# Altium schematic sheet Power_Inverter_350VDC.SchDoc
size 1200 x 800 mm; SheetNumber: 1; SheetTotal: 1
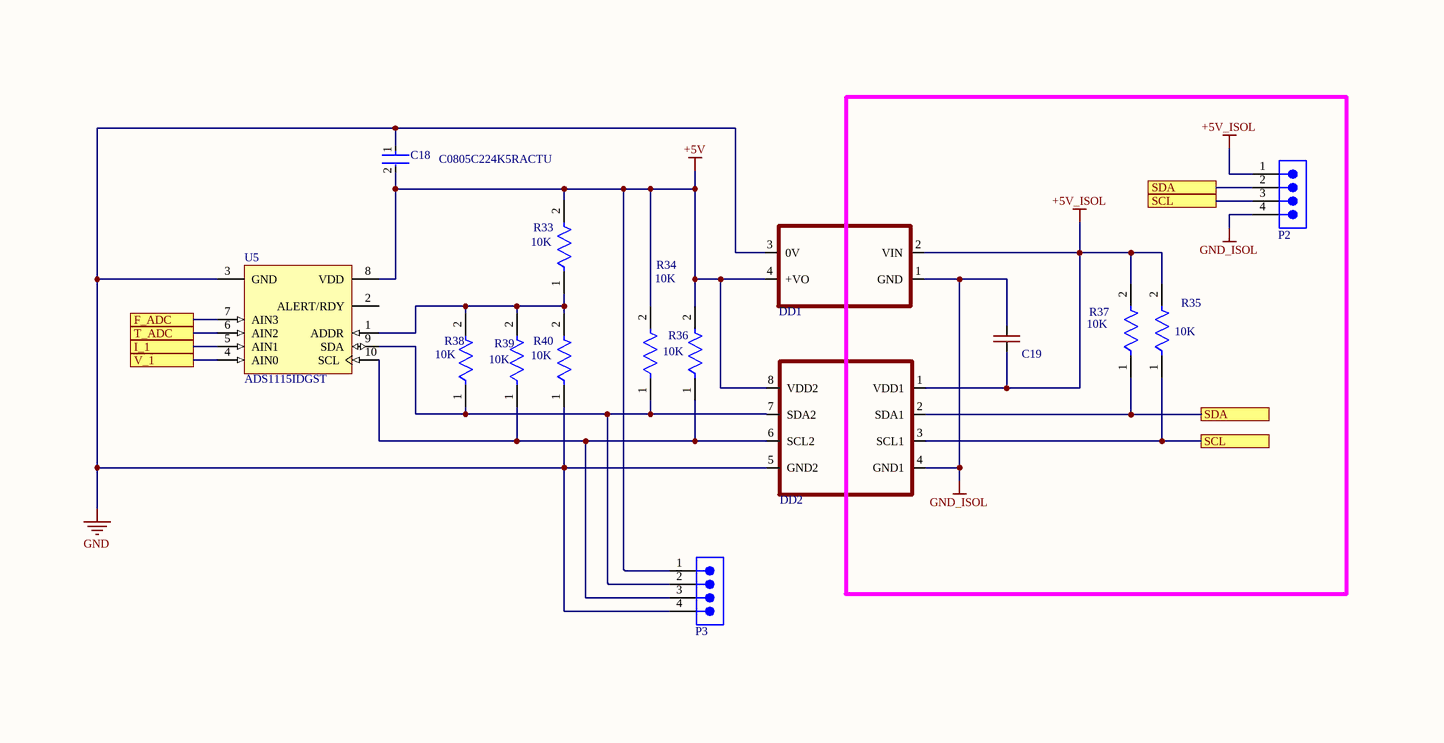
[diagram p0: Power_Inverter_350VDC.SchDoc, top column 1 of 4]
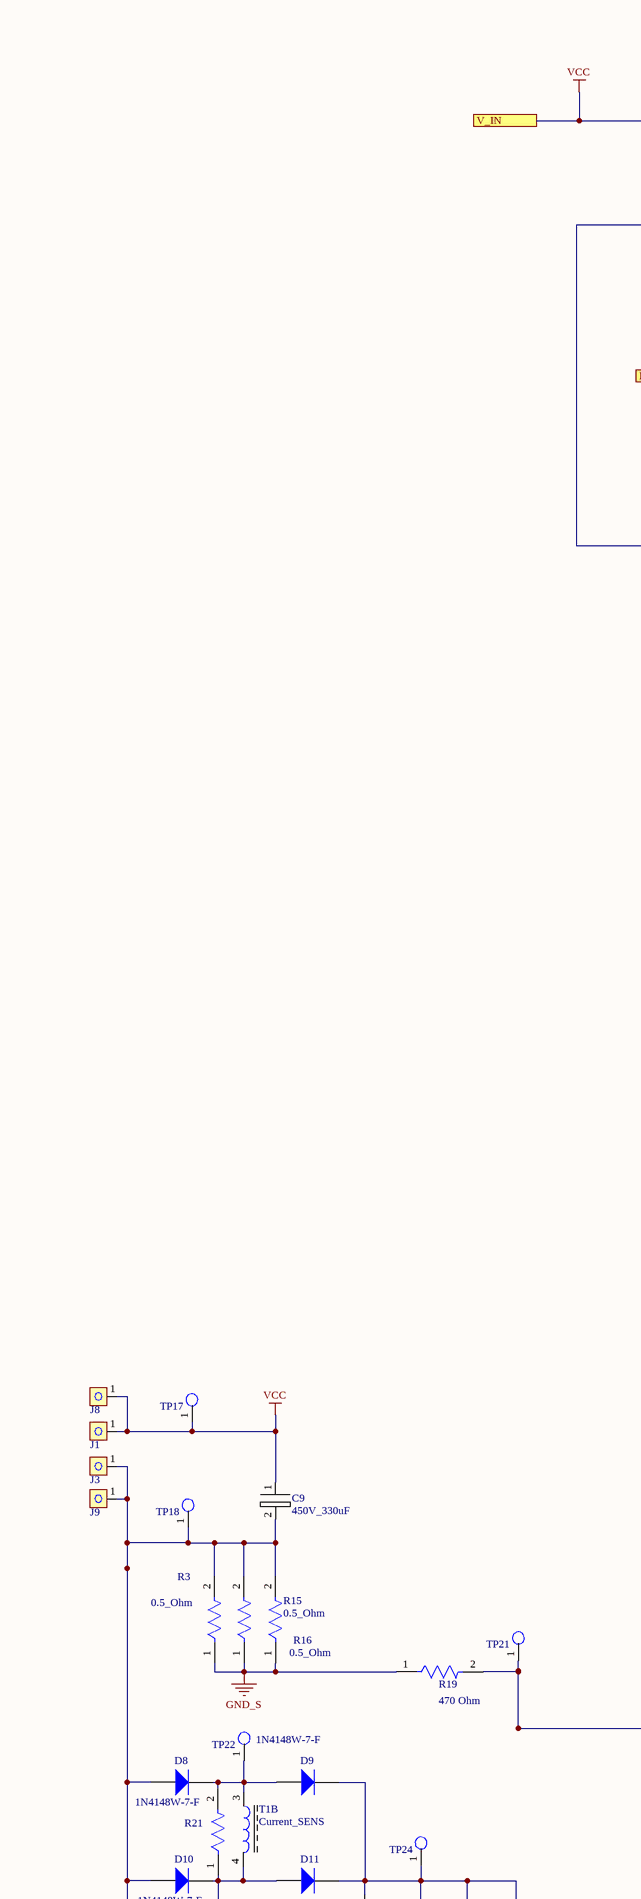
[diagram p1: Power_Inverter_350VDC.SchDoc, top column 2 of 4]
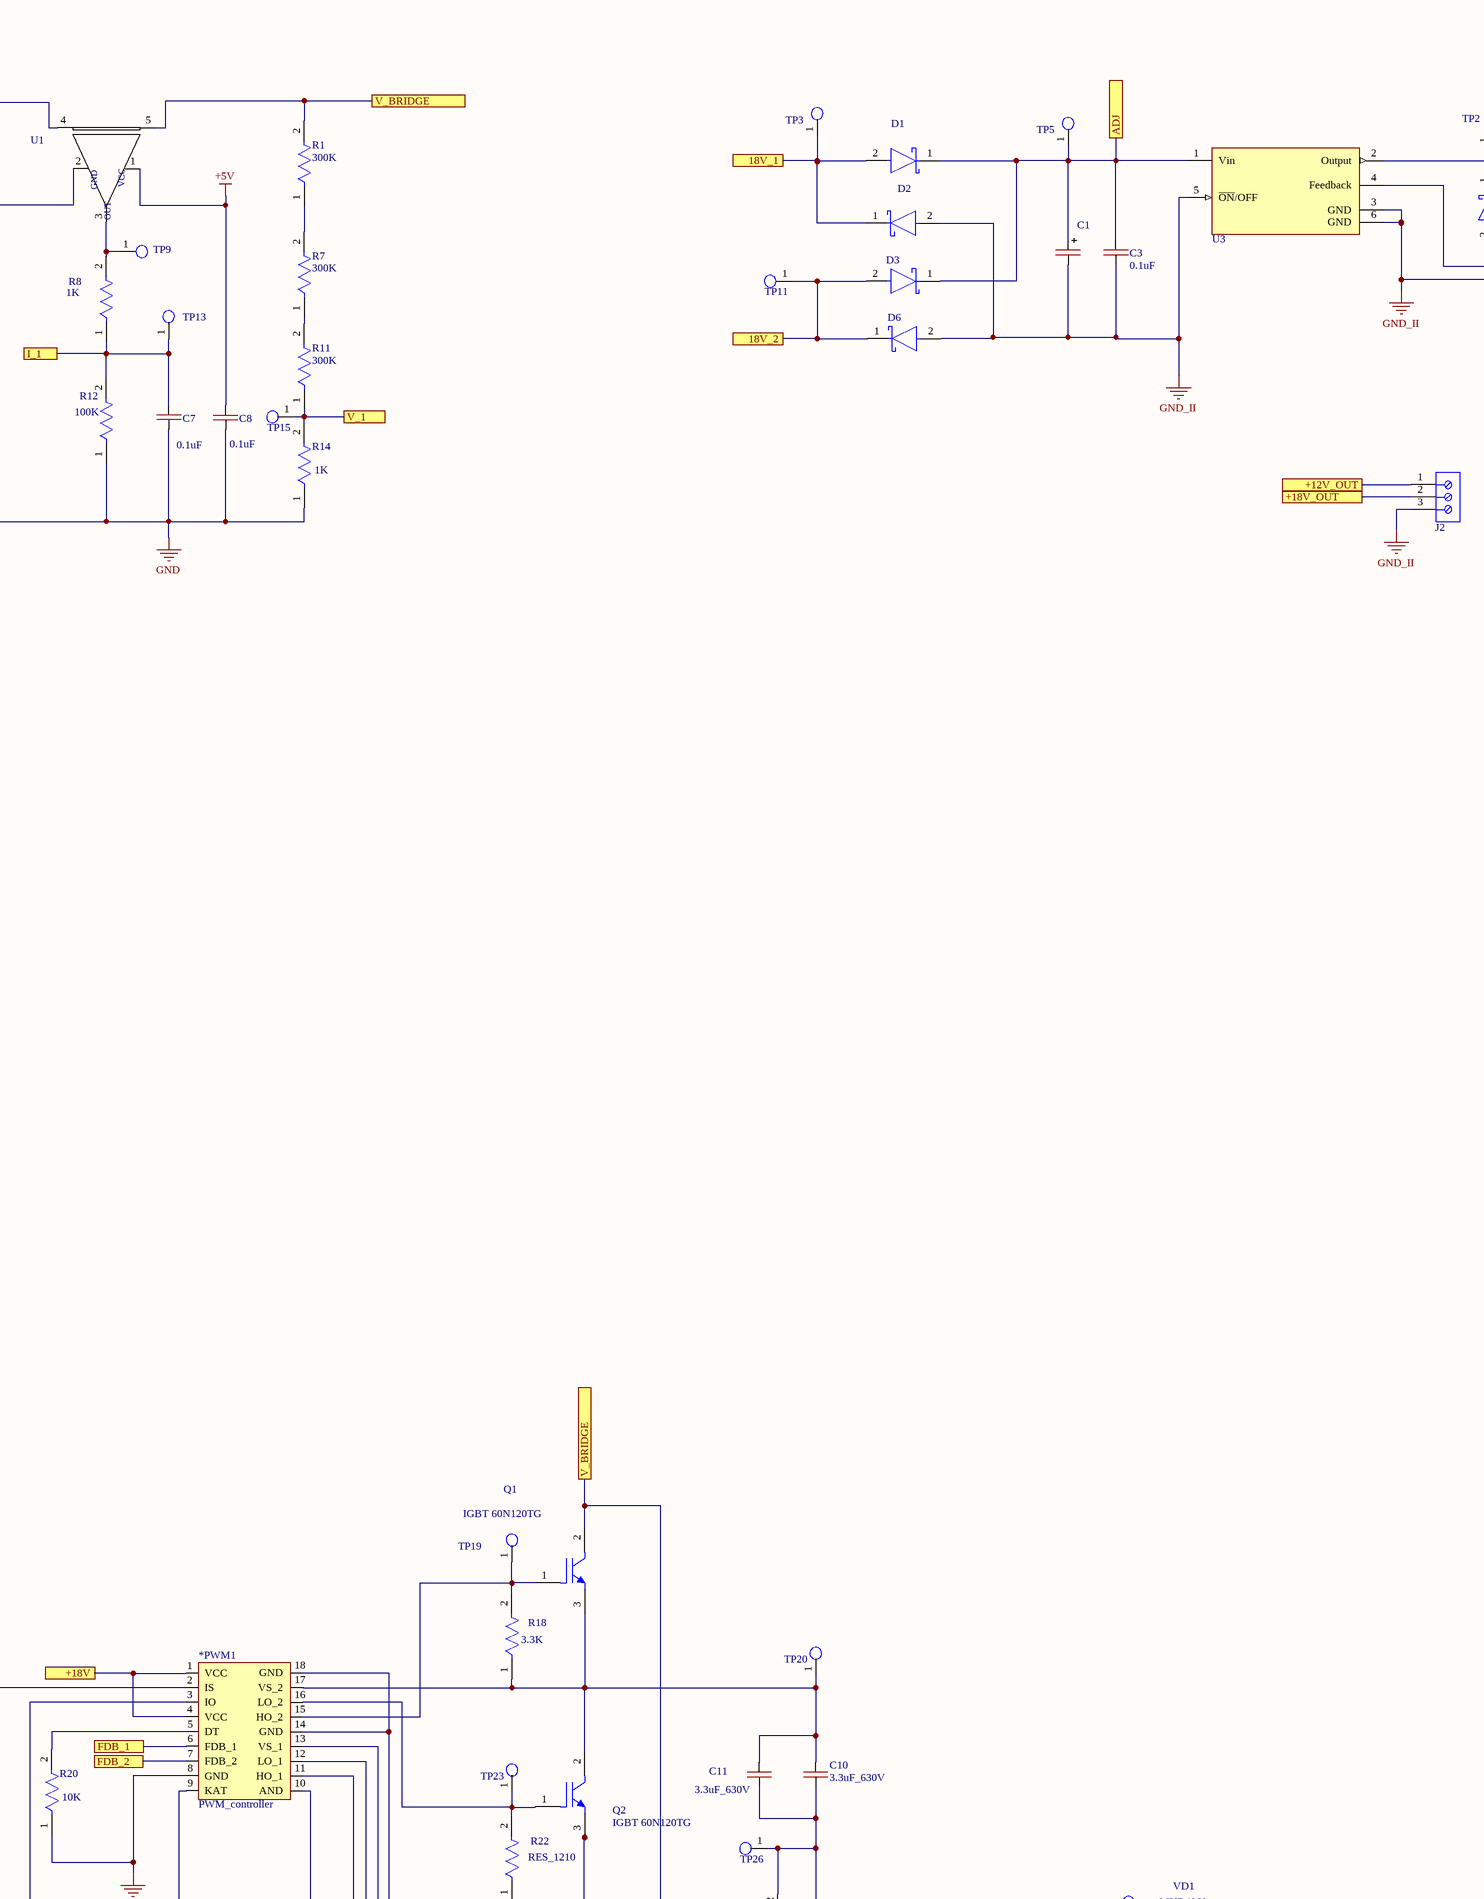
[diagram p2: Power_Inverter_350VDC.SchDoc, top column 3 of 4]
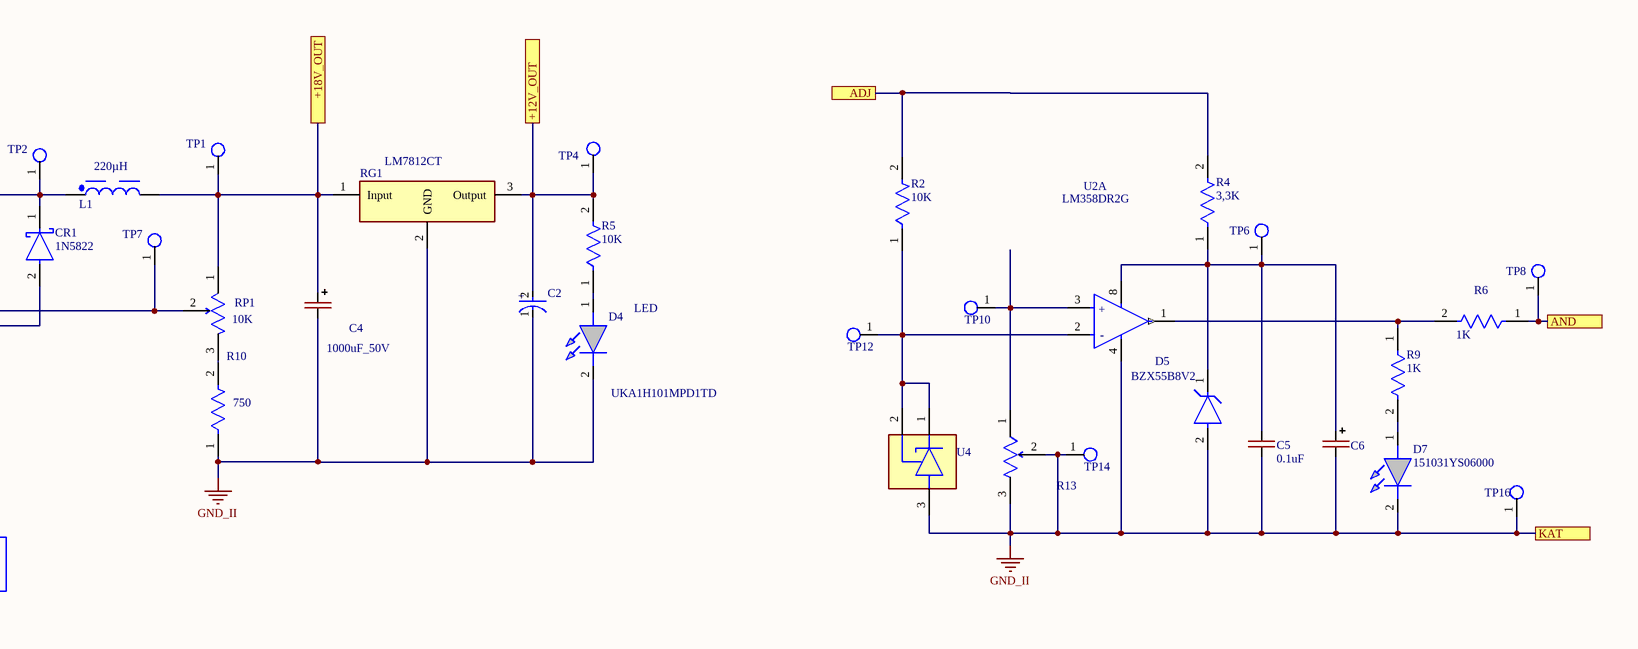
[diagram p3: Power_Inverter_350VDC.SchDoc, top column 4 of 4]
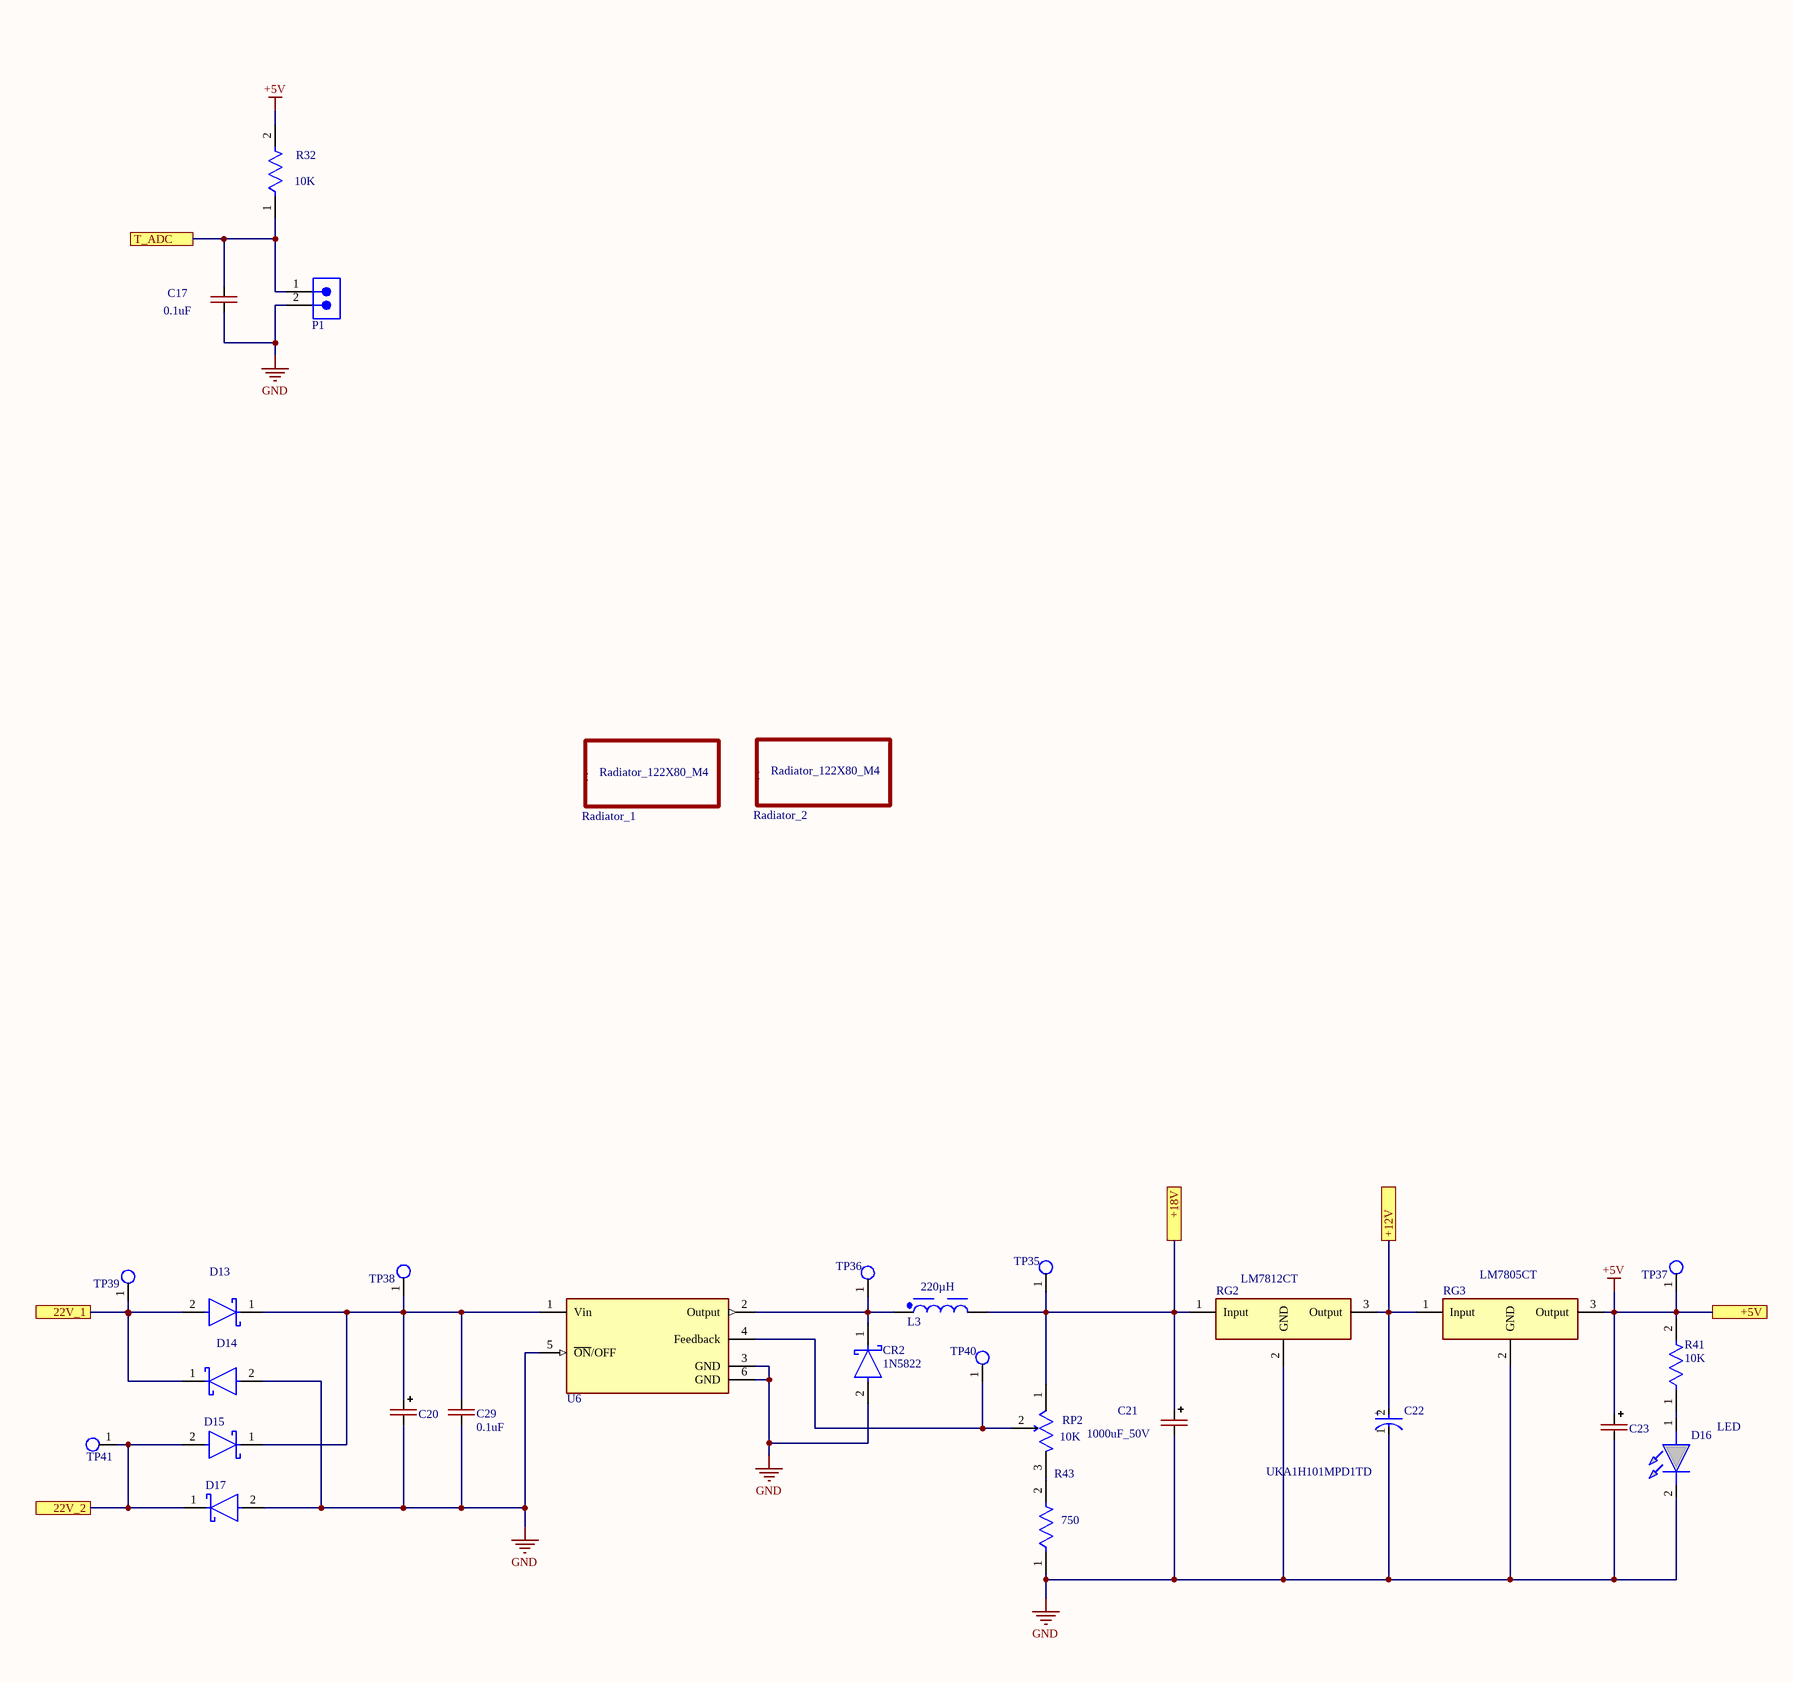
[diagram p4: Power_Inverter_350VDC.SchDoc, bottom column 1 of 4]
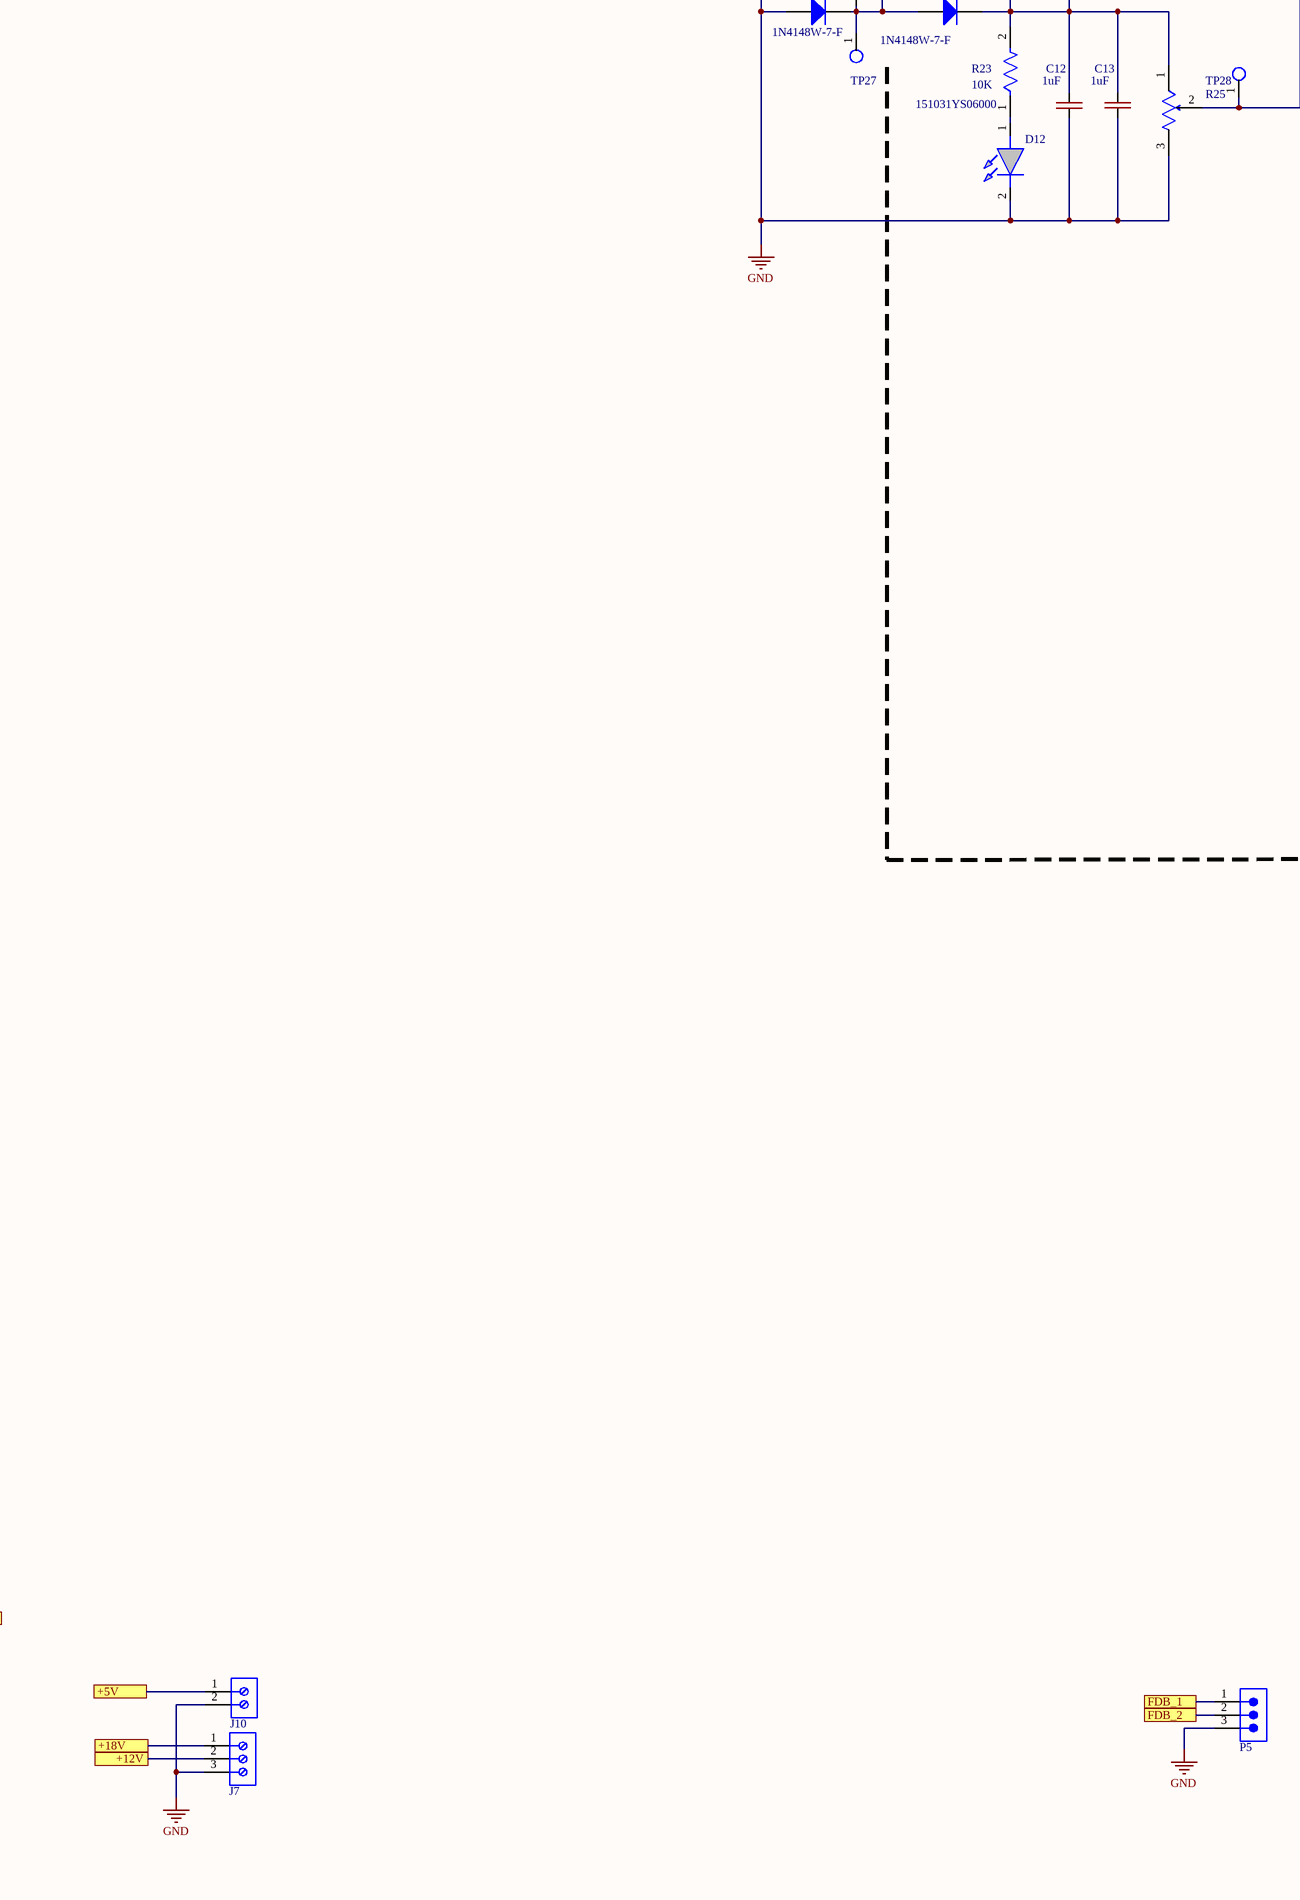
[diagram p5: Power_Inverter_350VDC.SchDoc, bottom column 2 of 4]
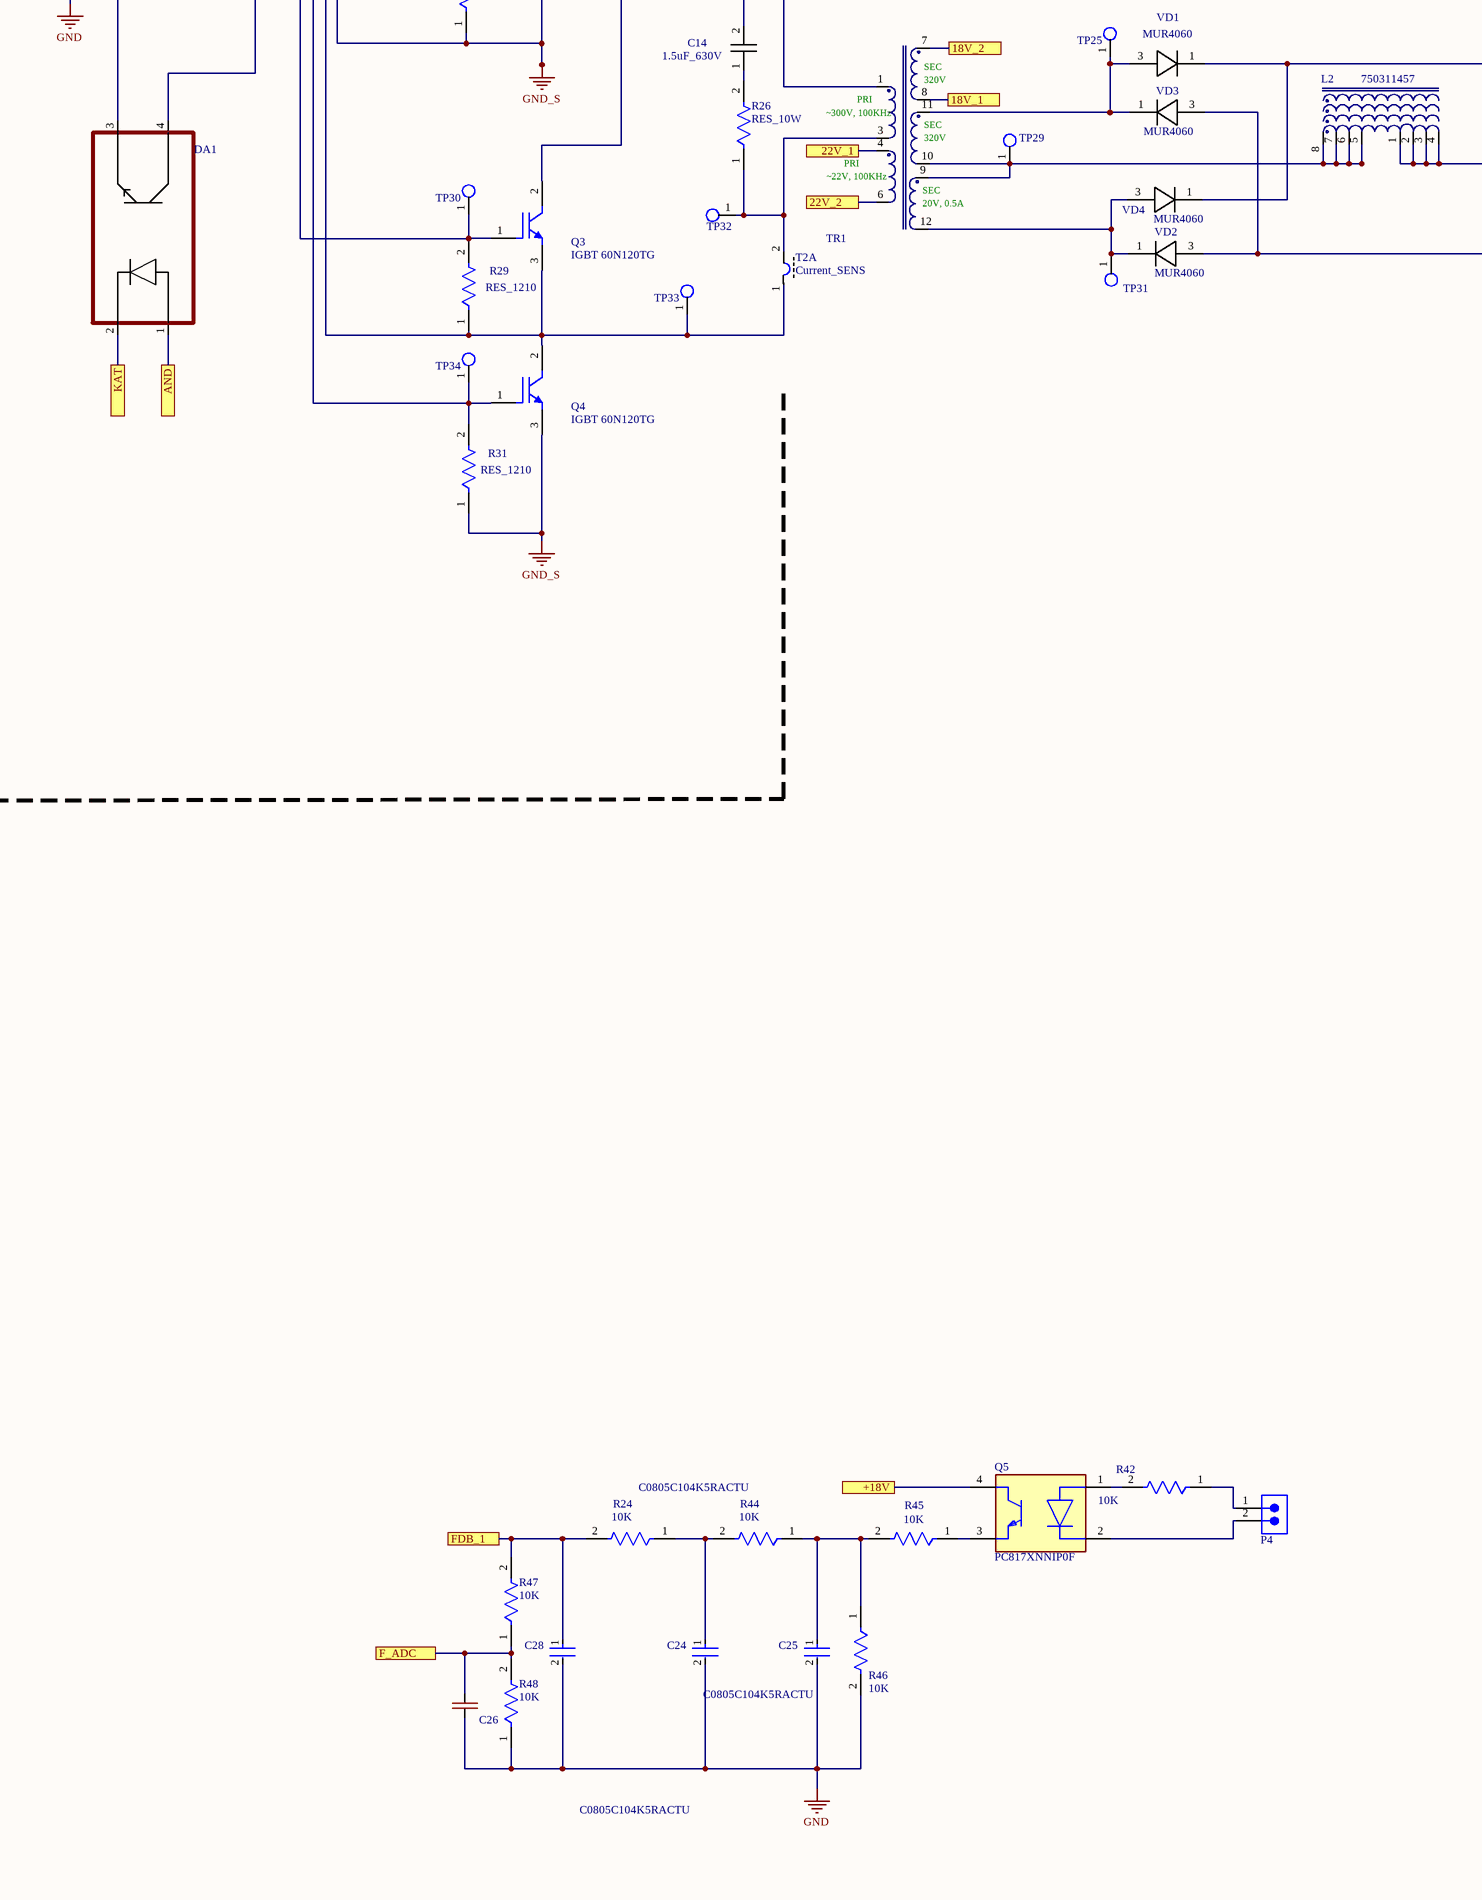
[diagram p6: Power_Inverter_350VDC.SchDoc, bottom column 3 of 4]
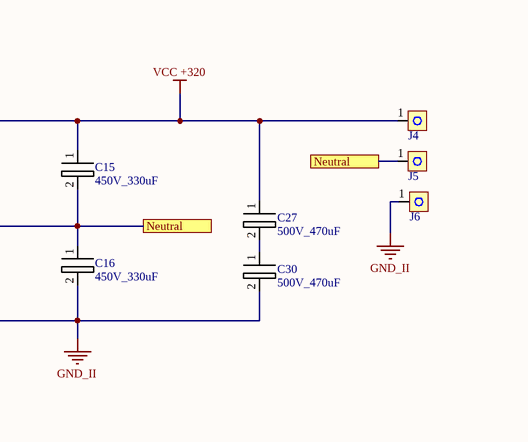
[diagram p7: Power_Inverter_350VDC.SchDoc, bottom column 4 of 4]

## Parts
*PWM1  PWM_controller  [PWM_controller]
C1  CAP-POLAR  [CAPPOL-16x25]  (value not drawn)
C2  UKA1H101MPD1TD  [FP-UKA1H101MPD1TD-MFG]
C3  0.1uF  [CAP-0805]
C4  1000uF_50V  [CAP_POL_13x26_1000uF_50V]
C5  0.1uF  [CAP-0805]
C6  CAP-POLAR  [CAP-TAN-D]  (value not drawn)
C7  0.1uF  [CAP-0805]
C8  0.1uF  [CAP-0805]
C9  450V_330uF  [CAP_450V_330uF]
C10  3.3uF_630V  [CAP_4.7uF_630V]
C11  3.3uF_630V  [CAP_4.7uF_630V]
C12  1uF  [CAP-0805]
C13  1uF  [CAP-0805]
C14  1.5uF_630V  [CAP_1.5uf_400V]
C15  450V_330uF  [CAP_450V_330uF]
C16  450V_330uF  [CAP_450V_330uF]
C17  0.1uF  [CAP-0805]
C18  C0805C224K5RACTU  [FP-C0805C-DN-MFG]
C19  CAP-NON-POLAR  [CAP-0805]  (value not drawn)
C20  CAP-POLAR  [CAPPOL-16x25]  (value not drawn)
C21  1000uF_50V  [CAP_POL_13x26_1000uF_50V]
C22  UKA1H101MPD1TD  [FP-UKA1H101MPD1TD-MFG]
C23  CAP-POLAR  [CAPPOL-16x25]  (value not drawn)
C24  C0805C104K5RACTU  [FP-C0805C-DN-MFG]
C25  C0805C104K5RACTU  [FP-C0805C-DN-MFG]
C26  CAP-NON-POLAR  [CAP-0805]  (value not drawn)
C27  500V_470uF  [CAP_450V_330uF]
C28  C0805C104K5RACTU  [FP-C0805C-DN-MFG]
C29  0.1uF  [CAP-0805]
C30  500V_470uF  [CAP_450V_330uF]
CR1  1N5822  [FP-DO-201AD-MFG]
CR2  1N5822  [FP-DO-201AD-MFG]
D1  (no value)  [SR5100(DO-201AD]
D2  (no value)  [SR5100(DO-201AD]
D3  (no value)  [SR5100(DO-201AD]
D4  LED  [LED_GREEN]
D5  BZX55B8V2  [BZX55B8V2]
D6  (no value)  [SR5100(DO-201AD]
D7  151031YS06000  [LED_BLUE]
D8  1N4148W-7-F  [DIOD-SOD123-2_V]
D9  1N4148W-7-F  [DIOD-SOD123-2_V]
D10  1N4148W-7-F  [DIOD-SOD123-2_V]
D11  1N4148W-7-F  [DIOD-SOD123-2_V]
D12  151031YS06000  [LED_GREEN]
D13  (no value)  [SR5100(DO-201AD]
D14  (no value)  [SR5100(DO-201AD]
D15  (no value)  [SR5100(DO-201AD]
D16  LED  [LED_GREEN]
D17  (no value)  [SR5100(DO-201AD]
DA1  PC817  [4-SMD]  (value not drawn)
DD1  B0505S-1W  [PLS-4-2.54mm]  (value not drawn)
DD2  ADUM1250ARZ  [SO8-150]  (value not drawn)
J1  MG_136_HT  [Conn_MEIGAN_MG136HT]  (value not drawn)
J2  691101710003  [691101710003]  (value not drawn)
J3  MG_136_HT  [Conn_MEIGAN_MG136HT]  (value not drawn)
J4  MG_136_HT  [Conn_MEIGAN_MG136HT]  (value not drawn)
J5  MG_136_HT  [Conn_MEIGAN_MG136HT]  (value not drawn)
J6  MG_136_HT  [Conn_MEIGAN_MG136HT]  (value not drawn)
J7  691101710003  [691101710003]  (value not drawn)
J8  MG_136_HT  [Conn_MEIGAN_MG136HT]  (value not drawn)
J9  MG_136_HT  [Conn_MEIGAN_MG136HT]  (value not drawn)
J10  691101710002  [691101710002]  (value not drawn)
L1  220µH  [WE-PD2_1054]
L2  750311457  [Drossel]
L3  220µH  [WE-PD2_1054]
P1  61900211121  [61900211121]  (value not drawn)
P2  61900411121  [61900411121]  (value not drawn)
P3  61900411121  [61900411121]  (value not drawn)
P4  61900211121  [61900211121]  (value not drawn)
P5  61900311121  [61900311121]  (value not drawn)
Q1  IGBT 60N120TG  [TO-264-3]
Q2  IGBT 60N120TG  [TO-264-3]
Q3  IGBT 60N120TG  [TO-264-3]
Q4  IGBT 60N120TG  [TO-264-3]
Q5  PC817XNNIP0F  [FP-PC817XNNIP0F-MFG]
R1  300K  [RES-1206]
R2  10K  [RES-1206]
R3  0.5_Ohm  [RES_5W_Ceramic_Yageo]
R4  3,3K  [RES-1206]
R5  10K  [FP-CRCW0805-e3-MFG]
R6  1K  [RES-0805]
R7  300K  [RES-1206]
R8  1K  [RES-0805]
R9  1K  [RES-0805]
R10  750  [RES-0805]
R11  300K  [RES-1206]
R12  100K  [RES-0805]
R13  10K  [RES_Adj_3296W_Bourns]  (value not drawn)
R14  1K  [FP-CRCW1210-e3-IPC_A]
R15  0.5_Ohm  [RES_5W_Ceramic_Yageo]
R16  0.5_Ohm  [RES_5W_Ceramic_Yageo]
R18  3.3K  [RES_SMD_1210_IPC_A]
R19  470 Ohm  [RES-0805]
R20  10K  [FP-CRCW1210-e3-IPC_A]
R21  CRCW12100000Z0EA  [FP-CRCW1210-e3-IPC_B]  (value not drawn)
R22  RES_1210  [RES_SMD_1210_IPC_A]
R23  10K  [RES-0805]
R24  10K  [RES-0805]
R25  3296W-1-202LF  [RES_Adj_3296W_Bourns]  (value not drawn)
R26  RES_10W  [10W 3 Ohm]
R29  RES_1210  [RES_SMD_1210_IPC_A]
R31  RES_1210  [RES_SMD_1210_IPC_A]
R32  10K  [RES-0805]
R33  10K  [RES-0805]
R34  10K  [RES-0805]
R35  10K  [RES-0805]
R36  10K  [RES-0805]
R37  10K  [RES-0805]
R38  10K  [RES-0805]
R39  10K  [RES-0805]
R40  10K  [RES-0805]
R41  10K  [FP-CRCW0805-e3-MFG]
R42  10K  [RES-0805]
R43  750  [RES-0805]
R44  10K  [RES-0805]
R45  10K  [RES-0805]
R46  10K  [RES-0805]
R47  10K  [RES-0805]
R48  10K  [RES-0805]
Radiator_1  Radiator_122X80_M4  [Radiator_122X80_M4]  (value not drawn)
Radiator_2  Radiator_122X80_M4  [Radiator_122X80_M4]  (value not drawn)
RG1  LM7812CT  [TO-220_Bended_Rad]
RG2  LM7812CT  [TO-220_Bended_Rad]
RG3  LM7805CT  [TO-220_Bended_Rad]
RP1  10K  [RES_Adj_3296W_Bourns]
RP2  10K  [RES_Adj_3296W_Bourns]
T1  Current_SENS  [Current_Sens_Case]  (part B of 2)
T2  Current_SENS  [Current_Sens_Case]  (part A of 2)
TP1  Test_Point_PCB  [Test_Point]  (value not drawn)
TP2  Test_Point_PCB  [Test_Point]  (value not drawn)
TP3  Test_Point_PCB  [Test_Point]  (value not drawn)
TP4  Test_Point_PCB  [Test_Point]  (value not drawn)
TP5  Test_Point_PCB  [Test_Point]  (value not drawn)
TP6  Test_Point_PCB  [Test_Point]  (value not drawn)
TP7  Test_Point_PCB  [Test_Point]  (value not drawn)
TP8  Test_Point_PCB  [Test_Point]  (value not drawn)
TP9  Test_Point_PCB  [Test_Point]  (value not drawn)
TP10  Test_Point_PCB  [Test_Point]  (value not drawn)
TP11  Test_Point_PCB  [Test_Point]  (value not drawn)
TP12  Test_Point_PCB  [Test_Point]  (value not drawn)
TP13  Test_Point_PCB  [Test_Point]  (value not drawn)
TP14  Test_Point_PCB  [Test_Point]  (value not drawn)
TP15  Test_Point_PCB  [Test_Point]  (value not drawn)
TP16  Test_Point_PCB  [Test_Point]  (value not drawn)
TP17  (no value)  [Test_Point]
TP18  Test_Point_PCB  [Test_Point]  (value not drawn)
TP19  Test_Point_PCB  [Test_Point]  (value not drawn)
TP20  Test_Point_PCB  [Test_Point]  (value not drawn)
TP21  Test_Point_PCB  [Test_Point]  (value not drawn)
TP22  Test_Point_PCB  [Test_Point]  (value not drawn)
TP23  Test_Point_PCB  [Test_Point]  (value not drawn)
TP24  Test_Point_PCB  [Test_Point]  (value not drawn)
TP25  Test_Point_PCB  [Test_Point]  (value not drawn)
TP26  Test_Point_PCB  [Test_Point]  (value not drawn)
TP27  Test_Point_PCB  [Test_Point]  (value not drawn)
TP28  Test_Point_PCB  [Test_Point]  (value not drawn)
TP29  Test_Point_PCB  [Test_Point]  (value not drawn)
TP30  Test_Point_PCB  [Test_Point]  (value not drawn)
TP31  Test_Point_PCB  [Test_Point]  (value not drawn)
TP32  Test_Point_PCB  [Test_Point]  (value not drawn)
TP33  Test_Point_PCB  [Test_Point]  (value not drawn)
TP34  Test_Point_PCB  [Test_Point]  (value not drawn)
TP35  Test_Point_PCB  [Test_Point]  (value not drawn)
TP36  Test_Point_PCB  [Test_Point]  (value not drawn)
TP37  Test_Point_PCB  [Test_Point]  (value not drawn)
TP38  Test_Point_PCB  [Test_Point]  (value not drawn)
TP39  Test_Point_PCB  [Test_Point]  (value not drawn)
TP40  Test_Point_PCB  [Test_Point]  (value not drawn)
TP41  Test_Point_PCB  [Test_Point]  (value not drawn)
TR1  EE85  [EE85_Ferrite_Core]  (value not drawn)
U1  ACS758  [ACS758-100]  (value not drawn)
U2  LM358DR2G  [FP-751-07-IPC_C]  (part A of 2)
U3  (no value)  [ON_Semiconductor_936A-02_MFG]
U4  (no value)  [TL431_SOT-23-3(A)]
U5  ADS1115IDGST  [TI-DGS10_N]
U6  (no value)  [ON_Semiconductor_936A-02_MFG]
VD1  MUR4060  [TO-247-2]
VD2  MUR4060  [TO-247-2]
VD3  MUR4060  [TO-247-2]
VD4  MUR4060  [TO-247-2]

## Ports
18V_1, 18V_2, 22V_1, 22V_2, +5V, +12V, +12V_OUT, +18V, +18V_OUT, ADJ, AND, F_ADC, FDB_1, FDB_2, I_1, KAT, Neutral, SCL, SDA, T_ADC, V_1, V_BRIDGE, V_IN

## Nets
+5V: C8.2 C18.2 C23.1(+) DD1.4(+VO) DD2.8(VDD2) J10.1 P3.1 R32.2 R33.2 R34.2 R36.2 R41.2 RG3.3(Output) TP37.1(G9) U1.1(+VCC) U5.8(VDD) ; port +5V
+5V_ISOL: C19.1 DD1.2(VIN) DD2.1(VDD1) P2.1 R35.2 R37.2
GND: *PWM1.8(GND) C7.2 C8.1 C9.2 C12.2 C13.2 C17.1 C18.1 C20.2(-) C21.2(-) C22.1(C) C23.2(-) C24.2 C25.2 C26.1 C28.2 C29.1 CR2.2(A) D8.1(K) D10.1(K) D12.2(K) D14.2(A) D16.2(K) D17.2(A) DD1.3(0V) DD2.5(GND2) J3.1 J7.3 J9.1 J10.2 P1.2 P3.4 P5.3 R3.2 R12.1 R14.1 R15.2 R16.2 R20.1 R25.3(CW) R40.1 R43.1 R46.2 R48.1 RG2.2(GND) RG3.2(GND) TP18.1(G9) U1.2(GND) U5.3(GND) U6.3(GND) U6.5(~{ON}/OFF) U6.6(GND)
GND_II: C1.2(-) C2.1(C) C3.1 C4.2(-) C5.1 C6.2(-) C16.2 C30.2 CR1.2(A) D2.2(A) D4.2(K) D5.2(A) D6.2(A) D7.2(K) DA1.2(CATHODE) J2.3 J6.1 R10.1 R13.2(WIPER) R13.3(CW) RG1.2(GND) TP14.1(G9) TP16.1(G9) U2.4(VEE/GND) U3.3(GND) U3.5(~{ON}/OFF) U3.6(GND) U4.3(A) VD2.3 VD3.3 ; port KAT
GND_ISOL: C19.2 DD1.1(GND) DD2.4(GND1) P2.4
GND_S: *PWM1.14(GND) *PWM1.18(GND) Q2.3(E) Q4.3(E) R3.1 R15.1 R16.1 R19.1 R22.1 R31.1
VCC: C9.1 J1.1 J8.1 TP17.1(G9) U1.4(+IP) ; port V_IN
VCC +320: C15.1 C27.1 J4.1 VD1.1 VD4.1
18V_1: D1.2(A) D2.1(C) TP3.1(G9) TR1.8 ; port 18V_1
18V_2: D3.2(A) D6.1(C) TP11.1(G9) TR1.7 ; port 18V_2
22V_1: D13.2(A) D14.1(C) TP39.1(G9) TR1.4 ; port 22V_1
22V_2: D15.2(A) D17.1(C) TP41.1(G9) TR1.6 ; port 22V_2
+12V: C22.2(A) J7.2 RG2.3(Output) RG3.1(Input) ; port +12V
+12V_OUT: C2.2(A) J2.1 R5.2 RG1.3(Output) TP4.1(G9) ; port +12V_OUT
+18V: *PWM1.1(VCC) *PWM1.4(VCC) C21.1(+) J7.1 L3.2 Q5.4(C) RG2.1(Input) RP2.1(CCW) TP35.1(G9) ; port +18V
+18V_OUT: C4.1(+) J2.2 L1.2 RG1.1(Input) RP1.1(CCW) TP1.1(G9) ; port +18V_OUT
ADJ: C1.1(+) C3.2 D1.1(C) D3.1(C) R2.2 R4.2 TP5.1(G9) U3.1(Vin) ; port ADJ
AND: DA1.1(ANODE) R6.1 TP8.1(G9) ; port AND
F_ADC: C26.2 R47.1 R48.2 U5.7(AIN3) ; port F_ADC
FDB_1: *PWM1.6(FDB_1) C28.1 P5.1 R24.2 R47.2 ; port FDB_1
FDB_2: *PWM1.7(FDB_2) P5.2 ; port FDB_2
I_1: C7.1 R8.1 R12.2 TP13.1(G9) U5.5(AIN1) ; port I_1
Neutral: C15.2 C16.1 J5.1 L2.1 L2.2 L2.3 L2.4 ; port Neutral
SCL: DD2.3(SCL1) P2.3 R35.1 ; port SCL
SDA: DD2.2(SDA1) P2.2 R37.1 ; port SDA
T_ADC: C17.2 P1.1 R32.1 U5.6(AIN2) ; port T_ADC
V_1: R11.1 R14.2 TP15.1(G9) U5.4(AIN0) ; port V_1
V_BRIDGE: Q1.2(C) Q3.2(C) R1.2 U1.5(-IP) ; port V_BRIDGE
Net*PWM1_2: *PWM1.2(IS) R19.2 TP21.1(G9)
Net*PWM1_3: *PWM1.3(IO) R25.2(WIPER) TP28.1(G9)
Net*PWM1_5: *PWM1.5(DT) R20.2
Net*PWM1_9: *PWM1.9(KAT) DA1.3(EMITTER)
Net*PWM1_10: *PWM1.10(AND) DA1.4(COLLECTOR)
Net*PWM1_11: *PWM1.11(HO_1) Q3.1(G) R29.2 TP30.1(G9)
Net*PWM1_12: *PWM1.12(LO_1) Q4.1(G) R31.2 TP34.1(G9)
Net*PWM1_13: *PWM1.13(VS_1) Q3.3(E) Q4.2(C) R29.1 T2.1 TP33.1(G9)
Net*PWM1_15: *PWM1.15(HO_2) Q1.1(G) R18.2 TP19.1(G9)
Net*PWM1_16: *PWM1.16(LO_2) Q2.1(G) R22.2 TP23.1(G9)
Net*PWM1_17: *PWM1.17(VS_2) C10.2 C11.2 Q1.3(E) Q2.2(C) R18.1 TP20.1(G9)
NetC5_2: C5.2 C6.1(+) D5.1(C) R4.1 TP6.1(G9) U2.8(VCC)
NetC10_1: C10.1 C11.1 C14.2 TP26.1(G9) TR1.1
NetC12_1: C12.1 C13.1 D9.2(A) D11.2(A) R23.2 R25.1(CCW) TP24.1(G9)
NetC14_1: C14.1 R26.2
NetC20_1: C20.1(+) C29.2 D13.1(C) D15.1(C) TP38.1(G9) U6.1(Vin)
NetC24_1: C24.1 R24.1 R44.2
NetC25_1: C25.1 R44.1 R45.2 R46.1
NetC27_2: C27.2 C30.1
NetCR1_1: CR1.1(C) L1.1 TP2.1(G9) U3.2(Output)
NetCR2_1: CR2.1(C) L3.1 TP36.1(G9) U6.2(Output)
NetD4_1: D4.1(A) R5.1
NetD7_1: D7.1(A) R9.2
NetD8_2: D8.2(A) D9.1(K) R21.2 T1.3 TP22.1(G9)
NetD10_2: D10.2(A) D11.1(K) R21.1 T1.4 TP27.1(G9)
NetD12_1: D12.1(A) R23.1
NetD16_1: D16.1(A) R41.1
NetDD2_6: DD2.6(SCL2) P3.3 R36.1 R39.1 U5.10(SCL)
NetDD2_7: DD2.7(SDA2) P3.2 R34.1 R38.1 U5.9(SDA)
NetL2_5: L2.5 L2.6 L2.7 L2.8 TP29.1(G9) TR1.9 TR1.10
NetP4_1: P4.1 R42.1
NetP4_2: P4.2 Q5.2(C)
NetQ5_1: Q5.1(A) R42.2
NetQ5_3: Q5.3(E) R45.1
NetR1_1: R1.1 R7.2
NetR2_1: R2.1 TP12.1(G9) U2.2(INPUT_A-) U4.1(C) U4.2(REF)
NetR6_2: R6.2 R9.1 U2.1(OUTPUT_A)
NetR7_1: R7.1 R11.2
NetR8_2: R8.2 TP9.1(G9) U1.3(OUT)
NetR10_2: R10.2 RP1.3(CW)
NetR13_1: R13.1(CCW) TP10.1(G9) U2.3(INPUT_A+)
NetR26_1: R26.1 T2.2 TP32.1(G9) TR1.3
NetR33_1: R33.1 R38.2 R39.2 R40.2 U5.1(ADDR)
NetR43_2: R43.2 RP2.3(CW)
NetRP1_2: RP1.2(WIPER) TP7.1(G9) U3.4(Feedback)
NetRP2_2: RP2.2(WIPER) TP40.1(G9) U6.4(Feedback)
NetTP25_1: TP25.1(G9) TR1.11 VD1.3 VD3.1
NetTP31_1: TP31.1(G9) TR1.12 VD2.1 VD4.3

Not connected (* = marked no-connect by the designer): U5 2(ALERT/RDY)

## Notes on the sheet
- (in symbol ACS758) VCC
- (in symbol CMP-1310-00291-2, part A) +; -
- (in symbol CMP-12462-000027-1) +
- (in symbol EE_85_IV) SEC; 320V; PRI; ~300V, 100KHz; ~22V, 100KHz; 20V, 0.5A

## Library data of the parts
C2 C22 = CMP-12462-000027-1: CAP ALUM 100UF 20% 50V RADIAL; Life (Hours): 2000Hour; Ripple Current: 190mA; Leakage Current: 4uA; Termination: Radial; Mount: Through Hole; Length: 11.5mm; Series: KA; Case/Package: Radial; Package Quantity: 1; REACH SVHC: No SVHC; Height - Seated (Max): 0.512inch; Min Operating Temperature: -55°C; Packaging: Tape and Reel; Tolerance: 20%; Lead Pitch: 3.5mm; Voltage Rating (DC): 50V; Voltage Rating: 50V; Diameter: 8mm; Height: 11.5mm; Max Operating Temperature: 105°C; Capacitance: 100uF
C3 C5 C7 C8 C10-C13 C17 C29 = CAP-NON-POLAR
C4 C21 = CAP_polar_Hitano
C9 = CAP_POL_LOW_IMP
C14 = 3.3uF_630V
C15 C16 C27 C30 = CAP_450V_330uF
C18 = CMP-1036-04552-2: CAP CER 0.22UF 50V X7R 0805; Manufacturer: KEMET; Value: 0.22 μF; Temperature Coefficient: 30ppm/°C; Material: Ceramic; Tolerance: 0.1; ComponentLink2URL: https://content.kemet.com/datasheets/KEM_C1003_C0G_SMD.pdf; Temperature Characteristic: X7R; Device Class L3: Ceramic Capacitors; Lead Free: Yes; Temperature: -55°C to +125°C; RoHS: TRUE; Capacitance: 0.22 μF; Automotive: No; Octopart: https://octopart.com/c0805c224k5ractu-kemet-144670; Manufacturer Part Number: C0805C224K5RACTU; Temperature Range Low: -55°C; Height: 0.88mm; Device Class L1: Passive Components; Digikey Description: CAP CER 0.22UF 50V X7R 0805; ComponentLink2Description: Datasheet; Mouser Description: CAP CER 0.22UF 50V X7R 0805; Category: Cap; Ipc Land Pattern Name: CAPC200125X78; Temperature Range High: +125°C; Package: C0805C-DN; Device Class L2: Capacitors; Voltage Rating: 50 V
C24 C25 C28 = CMP-2007-00279-2: CAP CER 0.1UF 50V X7R 0805; Manufacturer: KEMET; Value: 0.10 μF; Tolerance: 0.1; Temperature Coefficient: 30ppm/°C; Material: Ceramic; Manufacturer Part Number: C0805C104K5RACTU; Device Class L2: Capacitors; Temperature Range Low: -55°C; Voltage Rating: 50 V; Digikey Description: CAP CER 0.1UF 50V X7R 0805; Category: Cap; ComponentLink2Description: Datasheet; Octopart: https://octopart.com/c0805c104k5ractu-kemet-143926; RoHS: TRUE; ComponentLink2URL: https://content.kemet.com/datasheets/KEM_C1003_C0G_SMD.pdf; Temperature Characteristic: X7R; Temperature: -55°C to +125°C; Height: 0.88mm; Temperature Range High: +125°C; Device Class L1: Passive Components; Automotive: No; Lead Free: Yes; Ipc Land Pattern Name: CAPC200125X78; Device Class L3: Ceramic Capacitors; Mouser Description: Cap Ceramic 0.1uF 50V X7R 10% SMD 2.0 x 1.2 mm 125 C Paper T/R; Capacitance: 0.10 μF; Package: C0805C-DN
CR1 CR2 = 1N5822: DIODE SCHOTTKY 40V 3A DO201AD; Manufacturer: STMicroelectronics; Max Junction Temp: +150°C; Peak Reverse Current: 2mA; Max Surge Forward Current: 80A; Temperature Range High: +150°C; Automotive: No; RoHS: TRUE; ComponentLink2Description: Datasheet; Manufacturer Part Number: 1N5822; Lead Free: Yes; Octopart: https://octopart.com/1n5822-stmicroelectronics-323225; Device Class L2: Diodes; Max Repetitive Reverse Voltage: 40V; Temperature: to +150°C; Height: 5.3mm; Category: Diode; Digikey Description: DIODE SCHOTTKY 40V 3A DO201AD; ComponentLink2URL: https://www.st.com/resource/en/datasheet/1n5822.pdf; Device Class L3: Schottky Diodes; Device Class L1: Discrete Semiconductors; Forward Current: 3A; Mouser Description: Schottky Diodes & Rectifiers Vr/40V Io/3A BULK; Package: DO-201AD
D1-D3 D6 D13-D15 D17 = SR5100
D4 D7 D12 D16 = LED: WURTH ELEKTRONIK - 151031YS06000 - LED, Yellow, Through Hole, T-1 (3mm), 30 mA, 2 V, 590 nm; Geometry.Height: 5.5mm; Manufacturer_Name: Wurth Elektronik; Manufacturer_Part_Number: 151031YS06000; Mouser Part Number: 710-151031YS06000; Mouser Price/Stock: https://www.mouser.co.uk/ProductDetail/Wurth-Elektronik/151031YS06000?qs=LlUlMxKIyB3xSYYW%252BcuBiQ%3D%3D; Arrow Part Number: *; Arrow Price/Stock: *; Mouser Testing Part Number: *; Mouser Testing Price/Stock: *; Datasheet Link: https://katalog.we-online.de/led/datasheet/151031YS06000.pdf
D8-D11 = 1N4148: Fast Switching Diode, 100 V, 0.15 A, -65 to 150 degC, 2-Pin?SOD123, RoHS, Tape and Reel; Recovery Time: 4ns; Brand: DiodesIncorporated; Unit Weight: 0.000353oz; Max Surge Current: 2A; Peak Reverse Voltage: 100V; Ir - Reverse Current: 1uA; Vf - Forward Voltage: 1.25V; Configuration: Single; If - Forward Current: 0.15A; Product Category: Diodes-GeneralPurpose,Power,Switching; Operating Temperature Range: -65Cto+150C; Packaging: Reel; Manufacturer URL: http://www.diodes.com/; Maximum Operating Temperature: +150C; Height: 1.25mm; Minimum Operating Temperature: -65C; Product: SwitchingDiodes; Package URL: http://www.diodes.com/datasheets/ds18004.pdf; Type: SwitchingDiode; Package Reference: SOD123-2; Width: 1.7mm; Datasheet URL: http://www.farnell.com/datasheets/1915529.pdf; Datasheet Version: Rev. 24-2, 10/2013; Series: 1N4148; Factory Pack Quantity: 3000; Length: 2.85mm; RoHS: True; Manufacturer: DiodesIncorporated; Mounting Style: SMD/SMT; Package / Case: SOD-123
J1 J3-J6 J8 J9 = Connector_MEIGAN_MG136HT
J2 J7 = 691101710003: WR-TBL Series 101 Horizontal Entry Modular, THT, pitch 5mm, 3p; Manufacturer: Wurth Elektronik; Modularity: Yes; Rated Current: 16A; Working Voltage: 250V; ComponentLink1Description: Website Link; ComponentLink1URL: https://www.we-online.com/redexpert/article/691101710003?ad; ComponentLink2Description: Datasheet Link; ComponentLink2URL: https://www.we-online.com/redexpert/spec/691101710003?ad; Manufacturer Part Number: 691101710003; Category: Terminal Blocks; Match Code: WR-TBL; Mount: Through Hole; Operating Temperature Max: 105°C; Operating Temperature Min: -40°C; Packaging: Box; Application: Pressure Clamp; Number of Pins: 3; Number of Rows: 1; Orientation: Horizontal; Pitch: 5mm
J10 = 691101710002: WR-TBL Series 101 Horizontal Entry Modular, THT, pitch 5mm, 2p; Manufacturer: Wurth Elektronik; Modularity: Yes; Rated Current: 16A; Working Voltage: 250V; ComponentLink1Description: Website Link; ComponentLink1URL: https://www.we-online.com/redexpert/article/691101710002?ad; ComponentLink2Description: Datasheet Link; ComponentLink2URL: https://www.we-online.com/redexpert/spec/691101710002?ad; Manufacturer Part Number: 691101710002; Category: Terminal Blocks; Match Code: WR-TBL; Mount: Through Hole; Operating Temperature Max: 105°C; Operating Temperature Min: -40°C; Packaging: Box; Application: Pressure Clamp; Number of Pins: 2; Number of Rows: 1; Orientation: Horizontal; Pitch: 5mm
L1 L3 = 744776122: WE-PD2 SMT Power Inductor, size 1054, 22µH, 2.04A, 0.1Ω; Manufacturer: Wurth Elektronik; Case/Size Code: 1054; DC Resistance: 0.051Ω; Saturation Current: 2.07A; Self Resonant Frequency: 16MHz; Manufacturer Part Number: 744776122; Category: Unshielded Power Inductors; Match Code: WE-PD2; ComponentLink1Description: Website Link; ComponentLink1URL: https://www.we-online.com/redexpert/article/744776122?ad; ComponentLink2Description: Datasheet Link; ComponentLink2URL: https://www.we-online.com/redexpert/spec/744776122?ad; Mount: Surface Mount; Operating Temperature Max: 125°C; Operating Temperature Min: -40°C; Packaging: Tape and Reel; Length: 10mm; Width: 9mm; Height: 5.4mm; DC Resistance Max: 0.1Ω; Inductance: 22µH; Rated Current: 2.04A
L2 = DROSEL: Manufacturer: Wuerth Elektronik; Ui: 36V; ComponentLink1Description: Manufacturer URL; ComponentLink2Description: Datasheet; ComponentLink1URL: http://www.we-online.com; PartNumber: 750311457; PackageReference: EP13; ComponentLink2URL: http://katalog.we-online.de/pbs/datasheet/750311457.pdf
P1 P4 = 61900211121: WR-WTB THT Male Vertical Locking Header, pitch 2.54mm, 2pins; Manufacturer: Wurth Elektronik; Contact Resistance: 20mΩ; Rated Current: 3A; Working Voltage: 250VAC; Withstanding Voltage: 1000VAC; ComponentLink1Description: Website Link; ComponentLink1URL: https://www.we-online.com/redexpert/article/61900211121?ad; ComponentLink2Description: Datasheet Link; ComponentLink2URL: https://www.we-online.com/redexpert/spec/61900211121?ad; Manufacturer Part Number: 61900211121; Category: Wire-to-Board Connectors; Match Code: WR-WTB; Mount: Through Hole; Operating Temperature Max: 105°C; Operating Temperature Min: -40°C; Packaging: Bag; Length: 5.08mm; Width: 5.8mm; Height: 11.5mm; Gender: Male; Number of Pins: 2; Number of Rows: 1; Orientation: Vertical; Pitch: 2.54mm
P2 P3 = 61900411121: WR-WTB THT Male Vertical Locking Header, pitch 2.54mm, 4pins; Manufacturer: Wurth Elektronik; Contact Resistance: 20mΩ; Rated Current: 3A; Working Voltage: 250VAC; Withstanding Voltage: 1000VAC; ComponentLink1Description: Website Link; ComponentLink1URL: https://www.we-online.com/redexpert/article/61900411121?ad; ComponentLink2Description: Datasheet Link; ComponentLink2URL: https://www.we-online.com/redexpert/spec/61900411121?ad; Manufacturer Part Number: 61900411121; Category: Wire-to-Board Connectors; Match Code: WR-WTB; Mount: Through Hole; Operating Temperature Max: 105°C; Operating Temperature Min: -40°C; Packaging: Bag; Length: 10.16mm; Width: 5.8mm; Height: 11.5mm; Gender: Male; Number of Pins: 4; Number of Rows: 1; Orientation: Vertical; Pitch: 2.54mm
P5 = 61900311121: WR-WTB THT Male Vertical Locking Header, pitch 2.54mm, 3pins; Manufacturer: Wurth Elektronik; Contact Resistance: 20mΩ; Rated Current: 3A; Working Voltage: 250VAC; Withstanding Voltage: 1000VAC; ComponentLink1Description: Website Link; ComponentLink1URL: https://www.we-online.com/redexpert/article/61900311121?ad; ComponentLink2Description: Datasheet Link; ComponentLink2URL: https://www.we-online.com/redexpert/spec/61900311121?ad; Manufacturer Part Number: 61900311121; Category: Wire-to-Board Connectors; Match Code: WR-WTB; Mount: Through Hole; Operating Temperature Max: 105°C; Operating Temperature Min: -40°C; Packaging: Bag; Length: 7.62mm; Width: 5.8mm; Height: 11.5mm; Gender: Male; Number of Pins: 3; Number of Rows: 1; Orientation: Vertical; Pitch: 2.54mm
Q1-Q4 = IGBT 60N120T: IGBT 60N120T TO-264-3
Q5 = CMP-65434-000005-1: OPTOISOLATOR 5KV TRANS 4SMD; Reverse Breakdown Voltage: 6V; Output Current per Channel: 30mA; Power Dissipation: 200mW; Collector-emitter Voltage-Max: 200mV; Max Output Voltage: 80V; Input Current: 50mA; Forward Voltage: 1.4V; Fall Time: 18000ns; Number of Elements: 1; Input Type: DC; Packaging: Tape and Reel; RoHS Compliant: Yes; Contact Plating: Copper; Min Operating Temperature: -30°C; Collector Emitter Saturation Voltage: 200mV; Max Input Current: 50mA; Radiation Hardening: No; Max Collector Current: 50mA; Case/Package: SMD/SMT; Mount: Surface Mount; Output Voltage: 80V; Forward Current: 50mA; Max Power Dissipation: 200mW; Collector Emitter Voltage (VCEO): 80V; Number of Channels: 1; Rise Time: 18000ns; Isolation Voltage: 5kV; Number of Pins: 4; Lead Free: Lead Free; Package Quantity: 2000; Isolation Voltage-Max: 5kV; Max Operating Temperature: 100°C
R1-R4 R6-R12 R15 R16 R23 R24 R32-R40 R42-R48 = RES-CONST
R5 R41 = CMP-2001-04908-2: RES Thick Film, 10KΩ, 1%, 0.125W, 100ppm/°C, 0805; Resistance: 10kR; Voltage Rating (DC): 150V; Power Rating: 125mW; Weight: 0.000194oz; Package Quantity: 5000; Military Standard: Not; Max Operating Temperature: 155°C; Temperature Coefficient: 100ppm/°C; Contact Plating: Tin; Width: 1.25mm; Height: 0.45mm; Radiation Hardening: No; Tolerance: 1%; Min Operating Temperature: -55°C; Voltage Rating: 150V; Length: 2mm; Depth: 1.25mm; Termination: SMD/SMT; Packaging: Tape and Reel; Case/Package: 0805; Case Code (Metric): 2012; Lead Free: Lead Free; Case Code (Imperial): 0805; Composition: Thick Film
R13 R25 RP1 RP2 = RES_Adj
R14 = CMP-2005-01987-2: RES SMD 1K OHM 1% 1/2W 1992; Resistance: 0mR; Temperature Coefficient: 0ppm/°C; Max Power Dissipation: 500mW; Voltage Rating: 200V; Packaging: Tape and Reel; Max Operating Temperature: 155°C; REACH SVHC: No SVHC; Min Operating Temperature: -55°C; Package Quantity: 1; Length: 3.2mm; Case Code (Metric): 3225; Case/Package: 1210; Composition: Thick Film; Military Standard: Not; Contact Plating: Tin; Case Code (Imperial): 1210; Radiation Hardening: No; Depth: 2.5mm; Termination: SMD/SMT; Features: Automotive AEC-Q200; Width: 0.098inch; Mount: Surface Mount; Power Rating: 500mW; Weight: 0.000564oz; Number of Terminations: 2; Height: 0.55mm
R18 = RES_1210
R19 = RES-CONST: 470
R20 = CMP-2005-01987-2: RES SMD 10K OHM 1% 1/2W 1992; Resistance: 0mR; Temperature Coefficient: 0ppm/°C; Max Power Dissipation: 500mW; Voltage Rating: 200V; Packaging: Tape and Reel; Max Operating Temperature: 155°C; REACH SVHC: No SVHC; Min Operating Temperature: -55°C; Package Quantity: 1; Length: 3.2mm; Case Code (Metric): 3225; Case/Package: 1210; Composition: Thick Film; Military Standard: Not; Contact Plating: Tin; Case Code (Imperial): 1210; Radiation Hardening: No; Depth: 2.5mm; Termination: SMD/SMT; Features: Automotive AEC-Q200; Width: 0.098inch; Mount: Surface Mount; Power Rating: 500mW; Weight: 0.000564oz; Number of Terminations: 2; Height: 0.55mm
R21 = CMP-2005-01987-2: RES SMD 205K OHM 1% 1/2W 1992; Resistance: 0mR; Temperature Coefficient: 0ppm/°C; Max Power Dissipation: 500mW; Voltage Rating: 200V; Packaging: Tape and Reel; Max Operating Temperature: 155°C; REACH SVHC: No SVHC; Min Operating Temperature: -55°C; Package Quantity: 1; Length: 3.2mm; Case Code (Metric): 3225; Case/Package: 1210; Composition: Thick Film; Military Standard: Not; Contact Plating: Tin; Case Code (Imperial): 1210; Radiation Hardening: No; Depth: 2.5mm; Termination: SMD/SMT; Features: Automotive AEC-Q200; Width: 0.098inch; Mount: Surface Mount; Power Rating: 500mW; Weight: 0.000564oz; Number of Terminations: 2; Height: 0.55mm
RG1 RG2 = LM7812CT: REG IC REG LINEAR 12V 1A TO220AB; Manufacturer: Fairchild; Voltage Dropout (Max): 2V @ 1A (Typ); Voltage - Input (Max): 35V; Voltage - Output: 5V; helpURL: https://upverter.com/upn/revision/b27a7358b7dd93a3/; ComponentLink2Description: Datasheet; Temperature: -40°C to +125°C; Package: TO220; Supplier 2: Mouser; Price: 0.384521982769; Supplier 1: Digi-Key; ComponentLink1URL: https://upverter.com/upn/revision/b27a7358b7dd93a3/; Supplier Part Number 2: 512-LM7805CT; Supplier Part Number 1: LM7805CT-ND; ComponentLink1Description: Upverter; ComponentLink2URL: https://www.fairchildsemi.com/datasheets/LM/LM7805.pdf; RoHS: TRUE; Mouser Part Number: 512-LM7805CT; Ipc Land Pattern Name: TO-220; Temperature Range High: +125°C; Digikey Description: REG IC REG LINEAR 5V 1A TO220AB; Digikey Part Number: LM7805CT-ND; Lead Free: yes; Temperature Range Low: -40°C; Current-Output: 1A; Part Number: LM7812CT
RG3 = LM7805CT: REG IC REG LINEAR 5V 1A TO220AB; Manufacturer: Fairchild; Voltage Dropout (Max): 2V @ 1A (Typ); Voltage - Input (Max): 35V; helpURL: https://upverter.com/upn/revision/b27a7358b7dd93a3/; ComponentLink2Description: Datasheet; Temperature: -40°C to +125°C; Package: TO220; Supplier 2: Mouser; Price: 0.384521982769; Supplier 1: Digi-Key; ComponentLink1URL: https://upverter.com/upn/revision/b27a7358b7dd93a3/; Supplier Part Number 2: 512-LM7805CT; Supplier Part Number 1: LM7805CT-ND; ComponentLink1Description: Upverter; ComponentLink2URL: https://www.fairchildsemi.com/datasheets/LM/LM7805.pdf; RoHS: TRUE; Mouser Part Number: 512-LM7805CT; Ipc Land Pattern Name: TO-220; Temperature Range High: +125°C; Digikey Description: REG IC REG LINEAR 5V 1A TO220AB; Digikey Part Number: LM7805CT-ND; Lead Free: yes; Temperature Range Low: -40°C; Voltage - Output: 5V; Current-Output: 1A; Part Number: LM7805CT
TP1-TP41 = TP_PCB?: Test_Point
TR1 = EE_85_IV
U2 = CMP-1310-00291-2: IC OPAMP GP 2 CIRCUIT 8SOIC; Gain Bandwidth Product: 1MHz; Number of Circuits: 2; Min Supply Voltage: 3V; Slew Rate: 0.6V/µs; Max Dual Supply Voltage: 16V; Common Mode Rejection Ratio: 65dB; Input Bias Current: 250nA; Min Dual Supply Voltage: 1.5V; Dual Supply Voltage: 9V; Operating Supply Current: 1.5mA; Output Current: 40mA; Input Offset Voltage (Vos): 7mV; Nominal Supply Current: 1.2mA; Voltage Gain: 100dB; Max Supply Voltage: 32V; Width: 4mm; Number of Pins: 8; Min Operating Temperature: 0°C; REACH SVHC: No SVHC; Contact Plating: Tin; Lead Free: Lead Free; Halogen Free: Halogen Free; Power Supply Rejection Ratio (PSRR): 65dB; Operating Supply Voltage: 16V; Package Quantity: 2500; Max Operating Temperature: 70°C; Case/Package: SOIC; Height: 1.5mm; Packaging: Tape and Reel; Radiation Hardening: No; Number of Channels: 2; Bandwidth: 1MHz; Length: 5mm; Number of Elements: 2; Number of Amplifiers: 2; Output Current per Channel: 40mA
U3 U6 = LM2576D2T-005G
U4 = TL431_SOT-23-3
U5 = CMP-0003-00378-2: 16-Bit ADC with Integrated Multiplexer, PGA, Comparator, Oscillator, and Reference, -40 to 125 degC, 10-pin SOP (DGS10), Green (RoHS & no Sb/Br); Manufacturer: Texas Instruments; Sample Rate (max)(SPS): 860; SubFamily: Precision ADC (<=10MSPS); Architecture: Delta-Sigma; Digital Supply(Min)(V): 2; Resolution(Bits): 16; Digital Supply(Max)(V): 5.5; INL(Max)(+/-LSB): 1; Interface: Serial I2C; # Input Channels: 4; Eco-Plan: Green (RoHS & no Sb/Br); PackageDescription: 10-Pin Plastic Small Outline, Body 3 x 3 mm, Pitch 0.5 mm; Mounting Technology: Surface Mount; PackageReference: DGS10; DatasheetVersion: SBAS444B; ComponentLink3Description: Package Specification; ComponentLink1Description: Manufacturer URL; PartNumber: ADS1115IDGST; ComponentLink3URL: http://www.ti.com/lit/ml/mpds035b/mpds035b.pdf; ComponentLink2URL: http://www.ti.com/general/docs/lit/getliterature.tsp?genericPartNumber=ADS1115&fileType=pdf; Analog Voltage AV/DD(Min)(V): 2; ComponentLink2Description: Datasheet; PackageVersion: 4073272/C, 02/2004; Analog Voltage AV/DD(Max)(V): 5.5; Code_JEDEC: MO-153; ComponentLink1URL: http://www.ti.com/